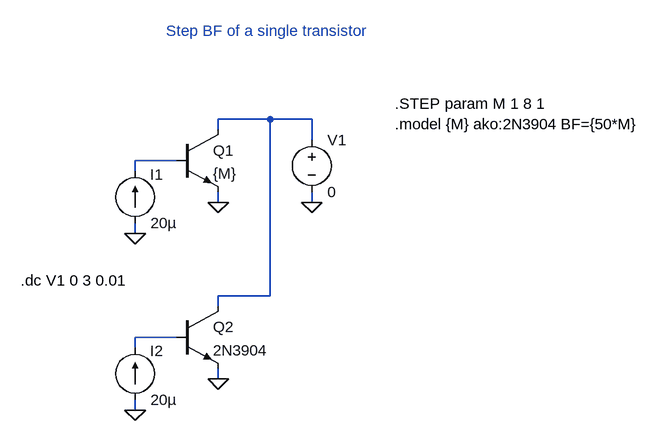
[diagram p0: schematic Step_BF_Single_NPN.asc]
Step_BF_Single_NPN.asc, the LTspice schematic file:
Version 4
SHEET 1 1012 720
WIRE 240 208 160 208
WIRE 304 208 240 208
WIRE 160 224 160 208
WIRE 304 240 304 208
WIRE 96 272 32 272
WIRE 32 288 32 272
WIRE 160 336 160 320
WIRE 304 336 304 320
WIRE 32 384 32 368
WIRE 240 480 240 208
WIRE 240 480 160 480
WIRE 160 496 160 480
WIRE 96 544 32 544
WIRE 32 560 32 544
WIRE 160 608 160 592
WIRE 32 656 32 640
FLAG 32 384 0
FLAG 160 336 0
FLAG 304 336 0
FLAG 32 656 0
FLAG 160 608 0
SYMBOL npn 96 224 R0
SYMATTR InstName Q1
SYMATTR Value {M}
SYMBOL voltage 304 224 R0
SYMATTR InstName V1
SYMATTR Value 0
SYMBOL current 32 368 M180
WINDOW 0 23 75 Left 0
WINDOW 3 24 0 Left 0
WINDOW 123 0 0 Left 0
WINDOW 39 0 0 Left 0
SYMATTR InstName I1
SYMATTR Value 20µ
SYMBOL npn 96 496 R0
SYMATTR InstName Q2
SYMATTR Value 2N3904
SYMBOL current 32 640 M180
WINDOW 0 23 75 Left 0
WINDOW 3 24 0 Left 0
WINDOW 123 0 0 Left 0
WINDOW 39 0 0 Left 0
SYMATTR InstName I2
SYMATTR Value 20µ
TEXT -144 456 Left 0 !.dc V1 0 3 0.01
TEXT 432 184 Left 0 !.STEP param M 1 8 1\n.model {M} ako:2N3904 BF={50*M}
TEXT 80 72 Left 0 ;Step BF of a single transistor

The netlist it stands for:
* Step_BF_Single_NPN.asc
Q1 N001 N002 0 0 {M}
V1 N001 0 0
I1 0 N002 20µ
Q2 N001 N003 0 0 2N3904
I2 0 N003 20µ
.model NPN NPN
.model PNP PNP
.lib standard.bjt
.dc V1 0 3 0.01
.STEP param M 1 8 1
.model {M} ako:2N3904 BF={50*M}
* Step BF of a single transistor
.backanno
.end